# Altium schematic sheet [2]Power_budget.SchDoc
size A0; DocumentNumber: 2; SheetNumber: 2; SheetTotal: 11
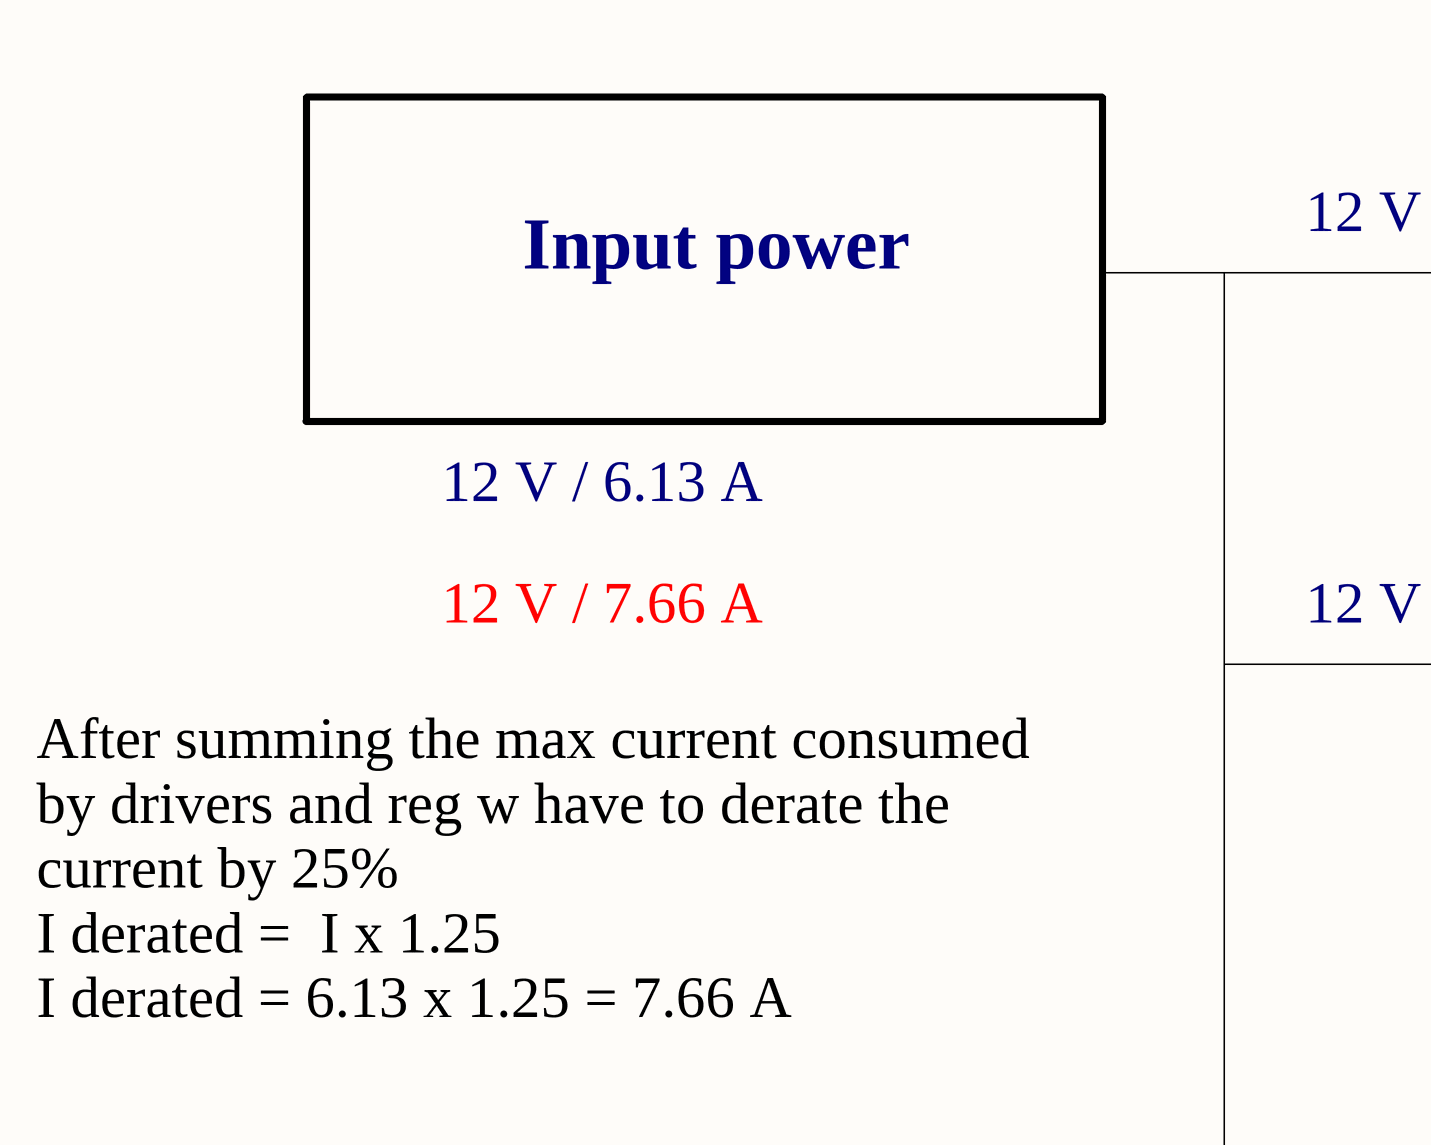
[diagram p0: [2]Power_budget.SchDoc, top left]
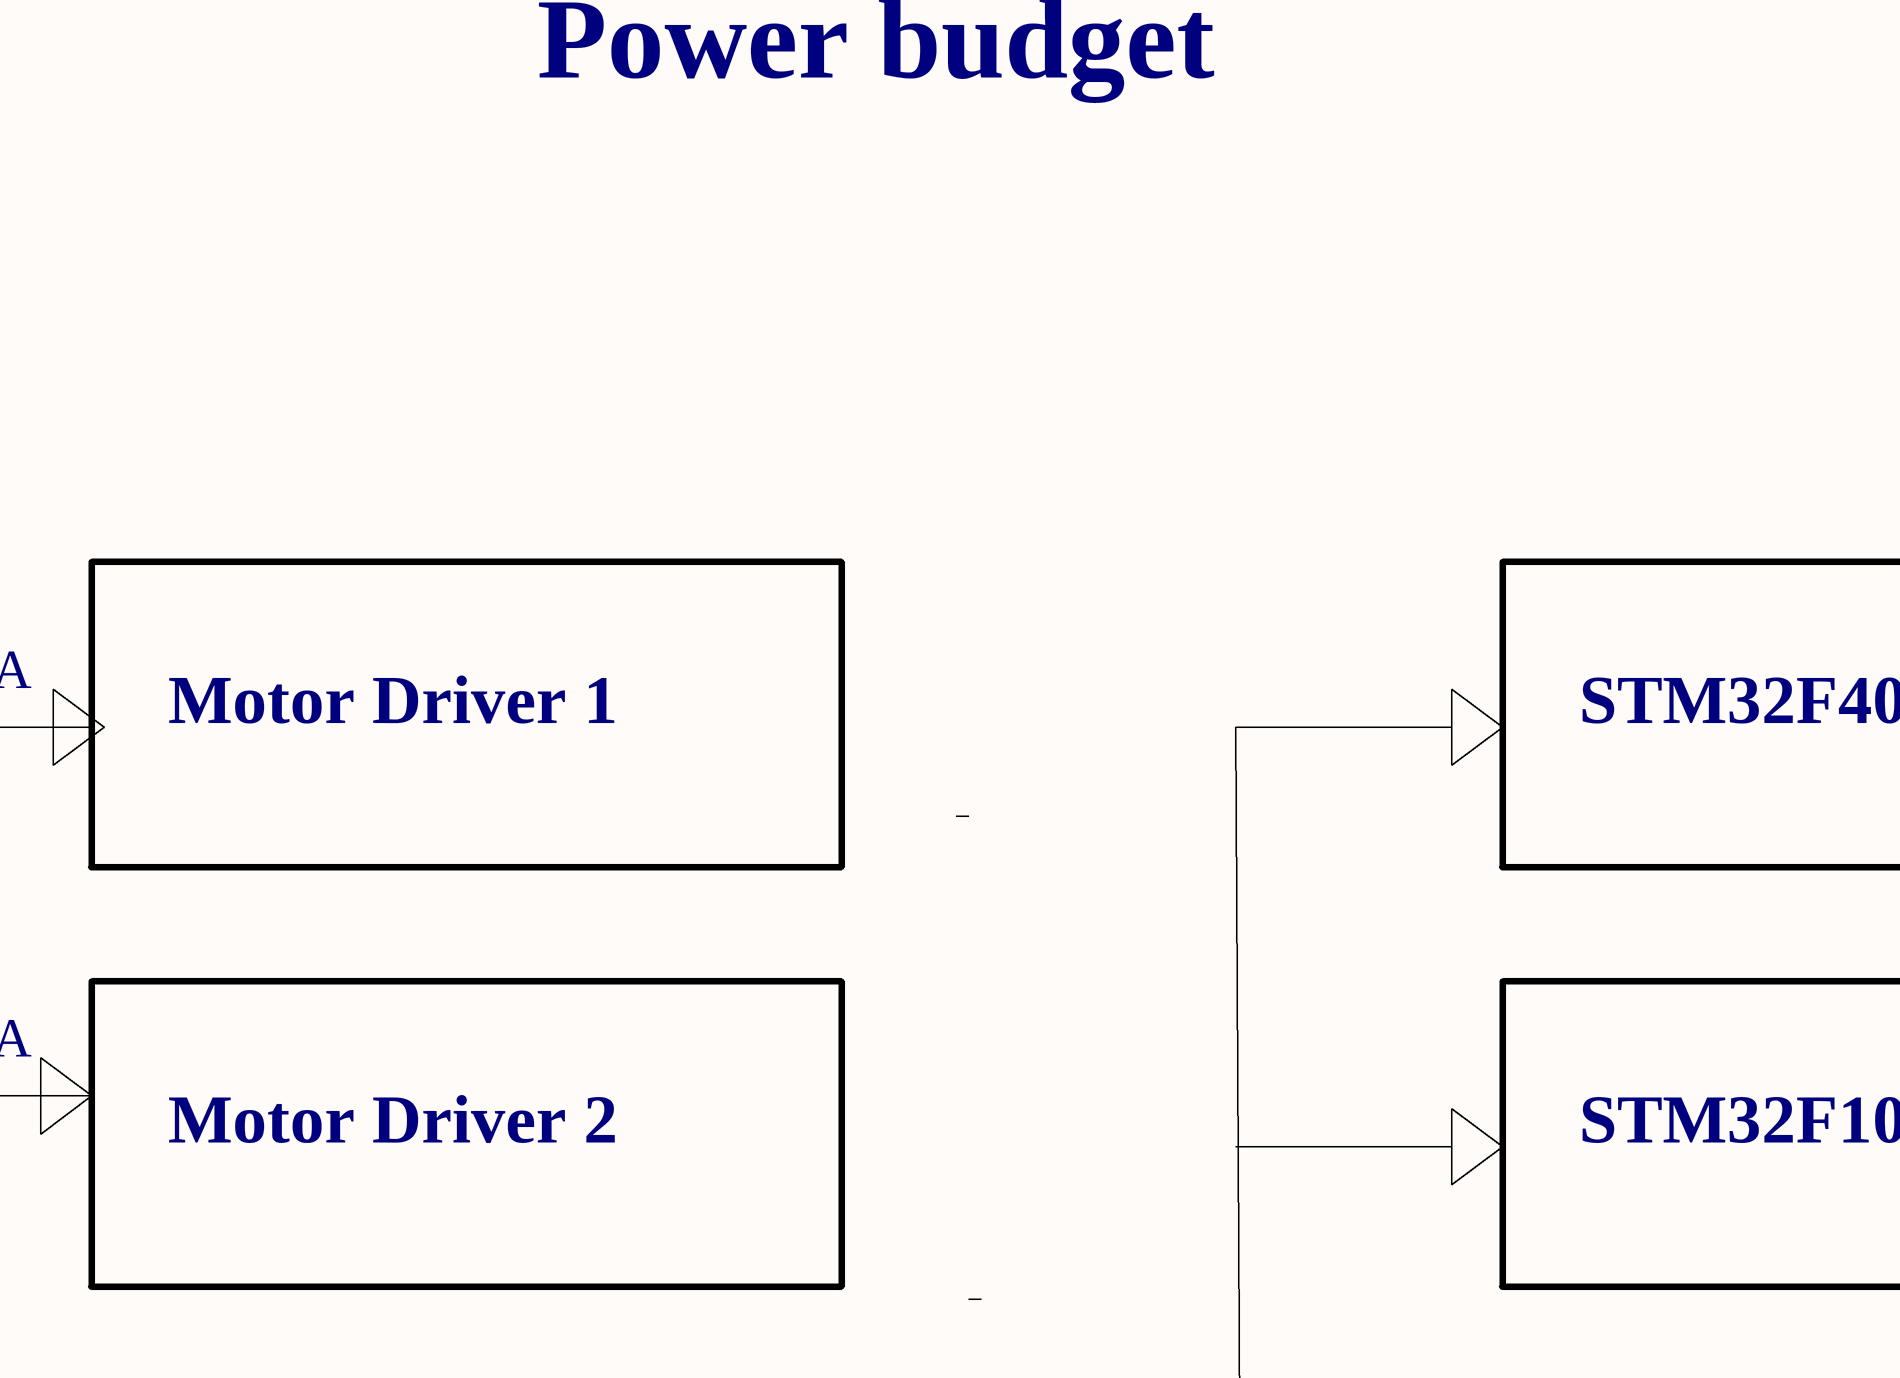
[diagram p1: [2]Power_budget.SchDoc, top middle]
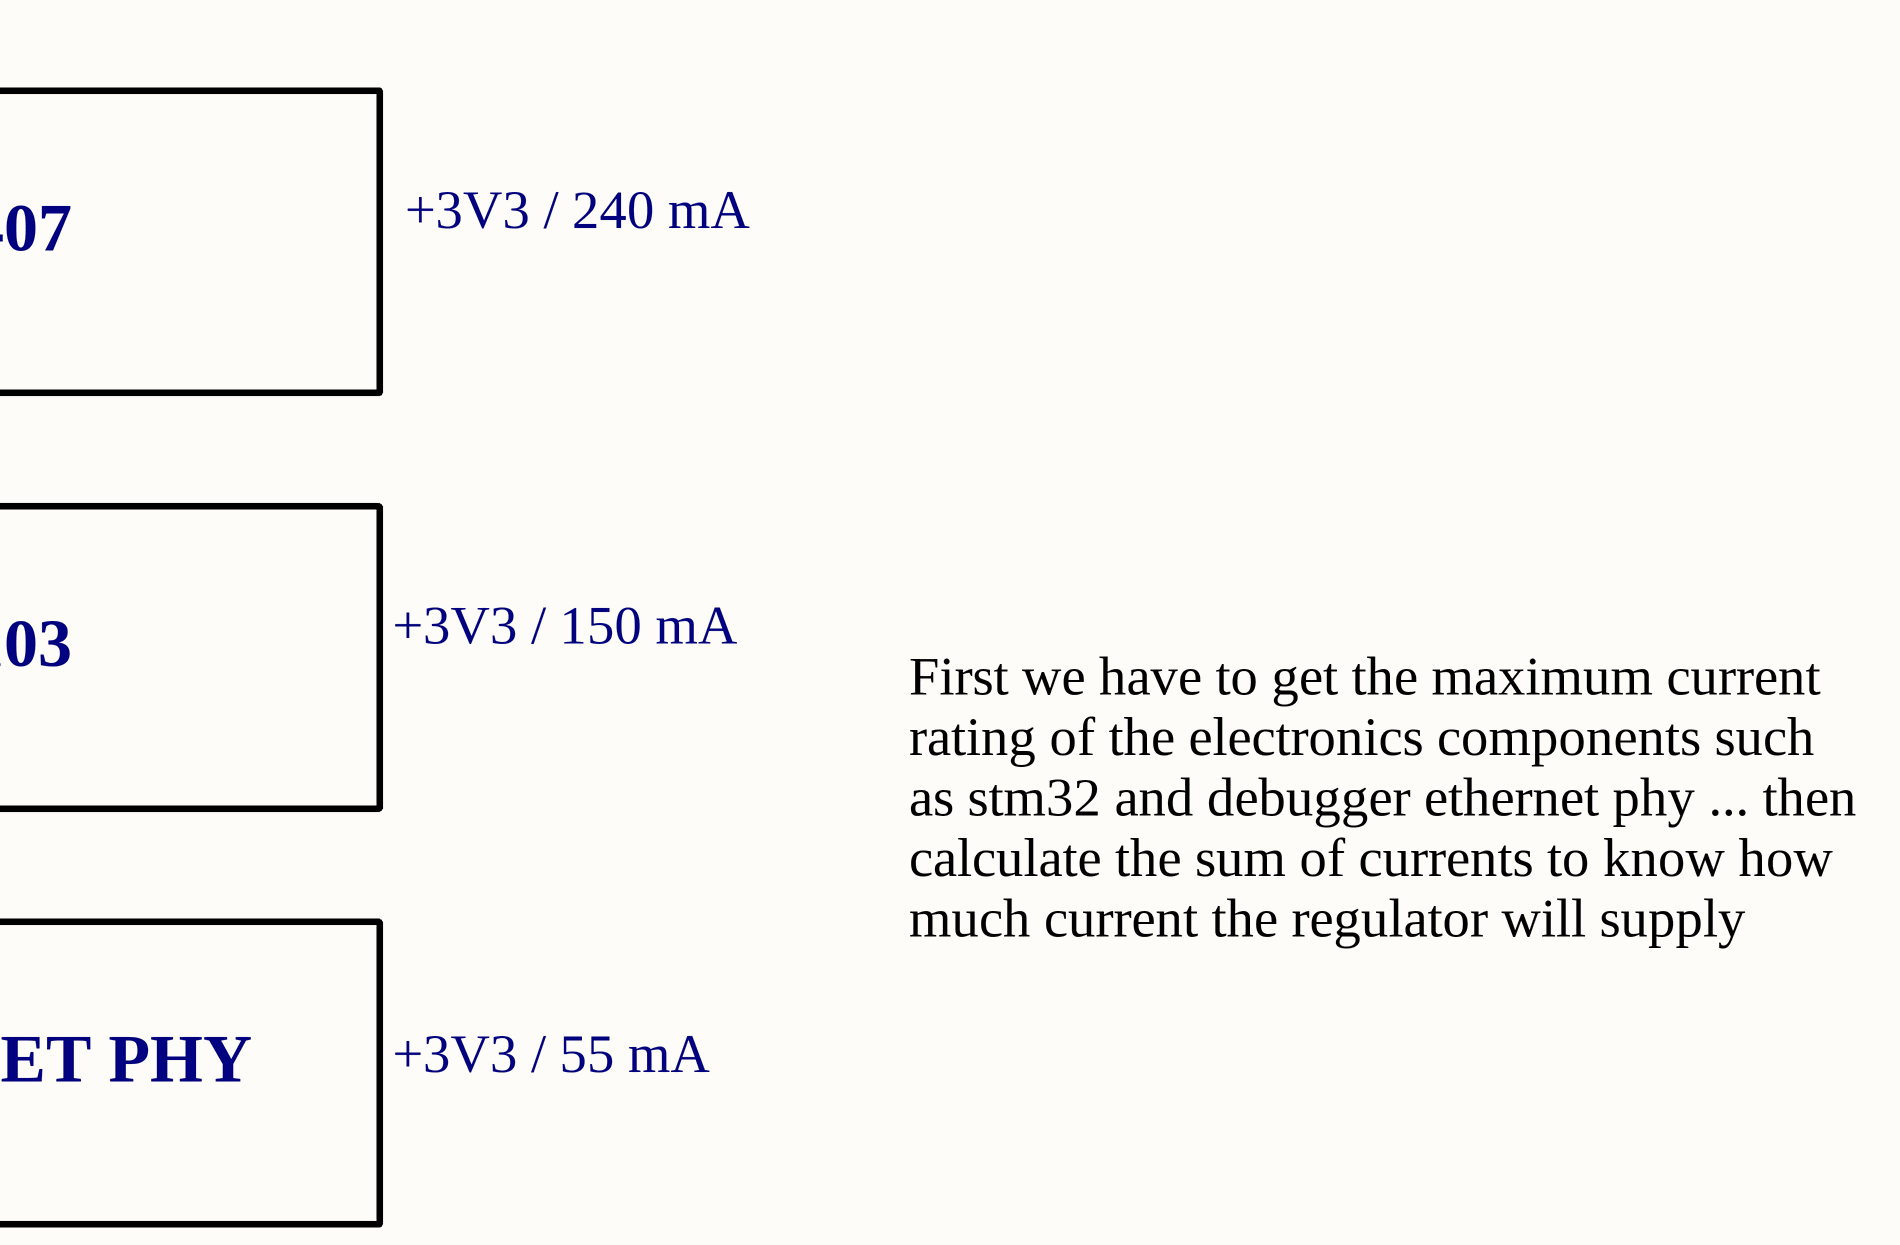
[diagram p2: [2]Power_budget.SchDoc, top right]
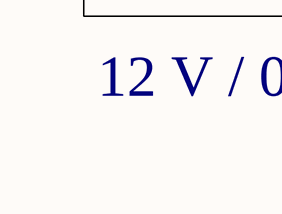
[diagram p3: [2]Power_budget.SchDoc, bottom left]
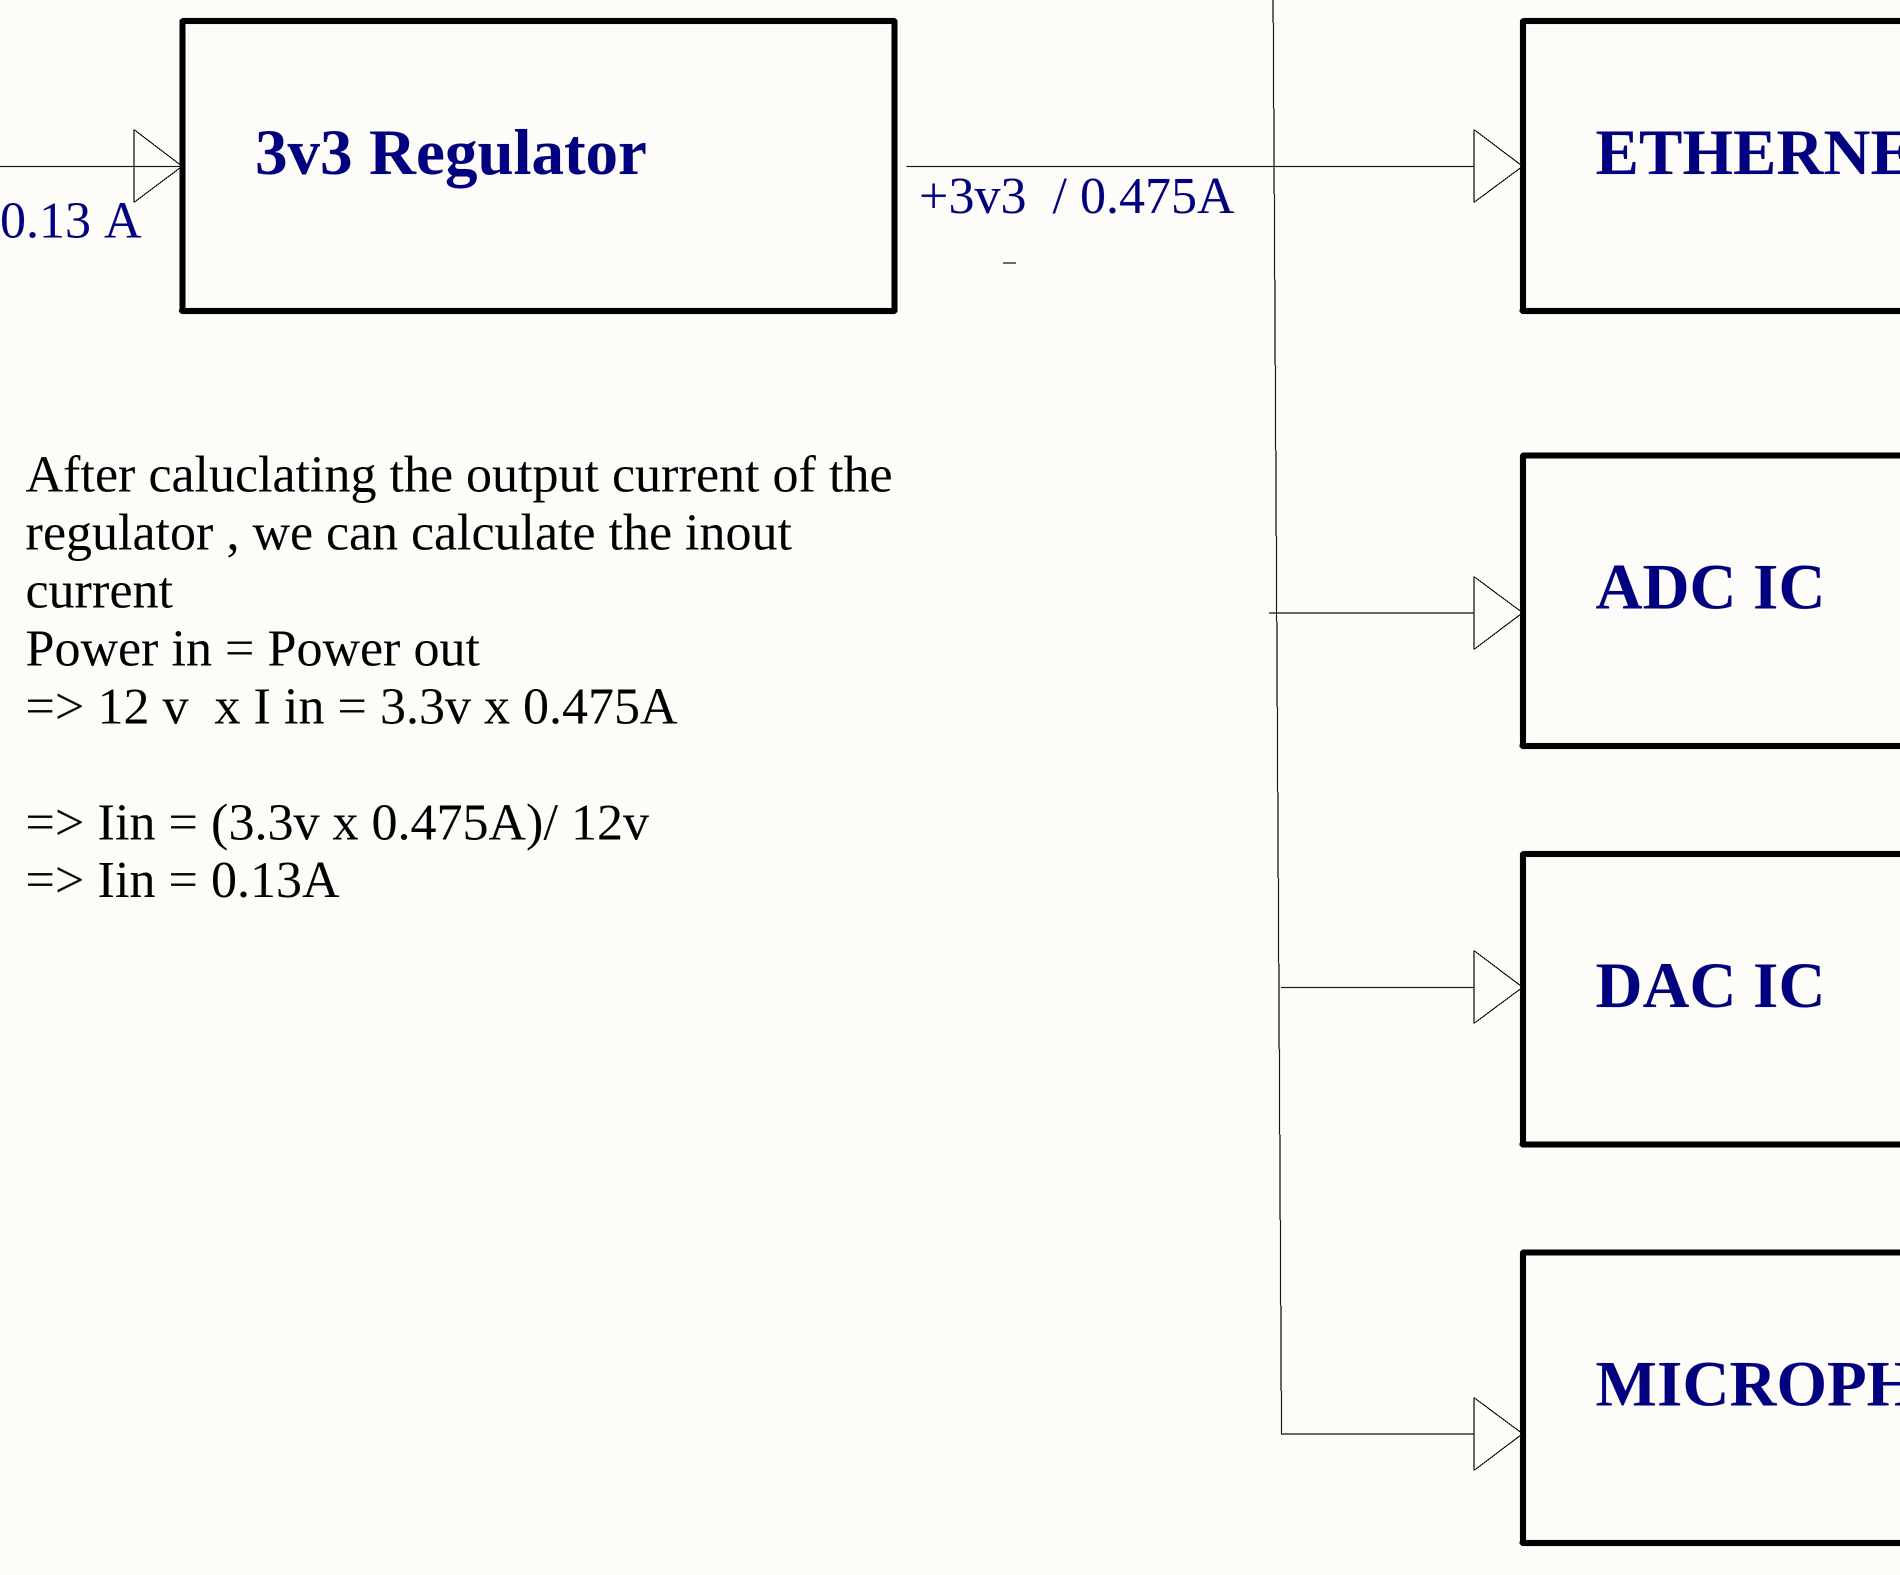
[diagram p4: [2]Power_budget.SchDoc, bottom middle]
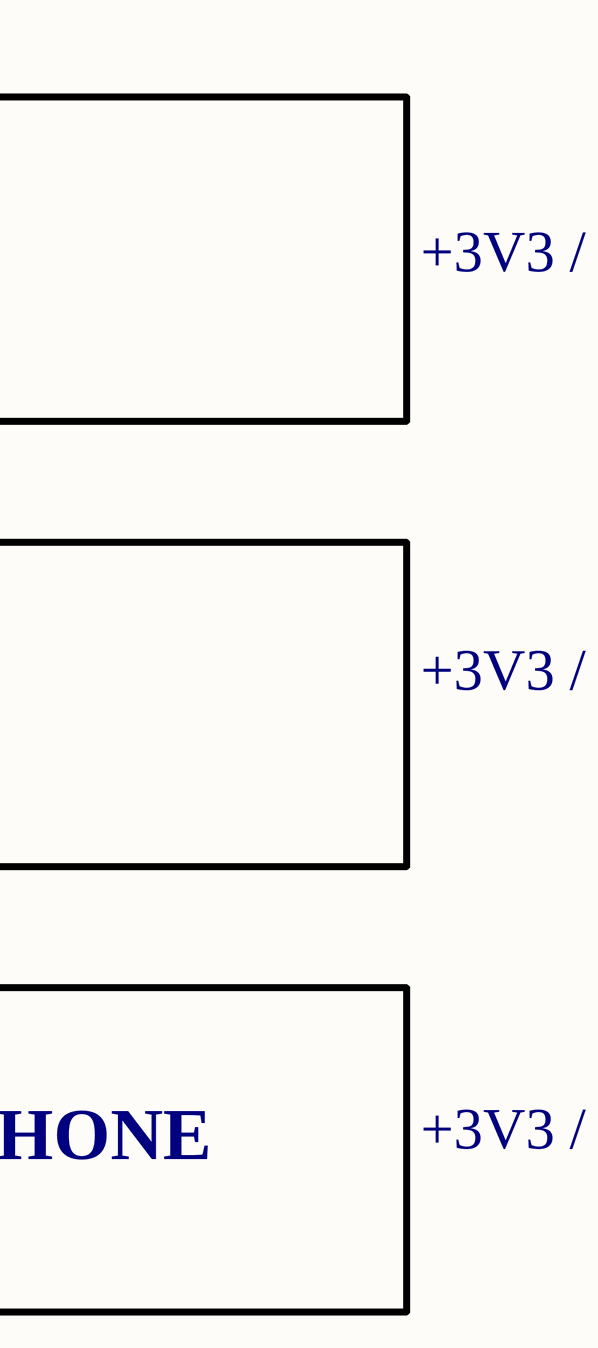
[diagram p5: [2]Power_budget.SchDoc, bottom right]

## Notes on the sheet
- Power budget
- 12 V / 3A
- Input power
- Motor Driver 1
- STM32F407
- +3V3 / 240 mA
- 12 V / 6.13 A
- 12 V / 7.66 A
- +3V3 / 150 mA
- Motor Driver 2
- STM32F103
- After summing the max current consumed by drivers and reg w have to derate the current by 25%
  I derated =  I x 1.25
  I derated = 6.13 x 1.25 = 7.66 A
- First we have to get the maximum current rating of the electronics components such as stm32 and debugger ethernet phy ... then calculate the sum of currents to know how much current the regulator will supply
- 3v3 Regulator
- ETHERNET PHY
- +3V3 / 55 mA
- 12 V / 0.13 A
- +3v3  / 0.475A
- ADC IC
- +3V3 / 10 mA
- After caluclating the output current of the regulator , we can calculate the inout current
  Power in = Power out
  => 12 v  x I in = 3.3v x 0.475A
  => Iin = (3.3v x 0.475A)/ 12v
  => Iin = 0.13A
- DAC IC
- MICROPHONE
- Title
- Size:
- Date:
- File:
- A0
- Number:
- Time:
- Revision:
- Sheet
- of